# EAGLE design V2 (EAGLE 9.6.2)
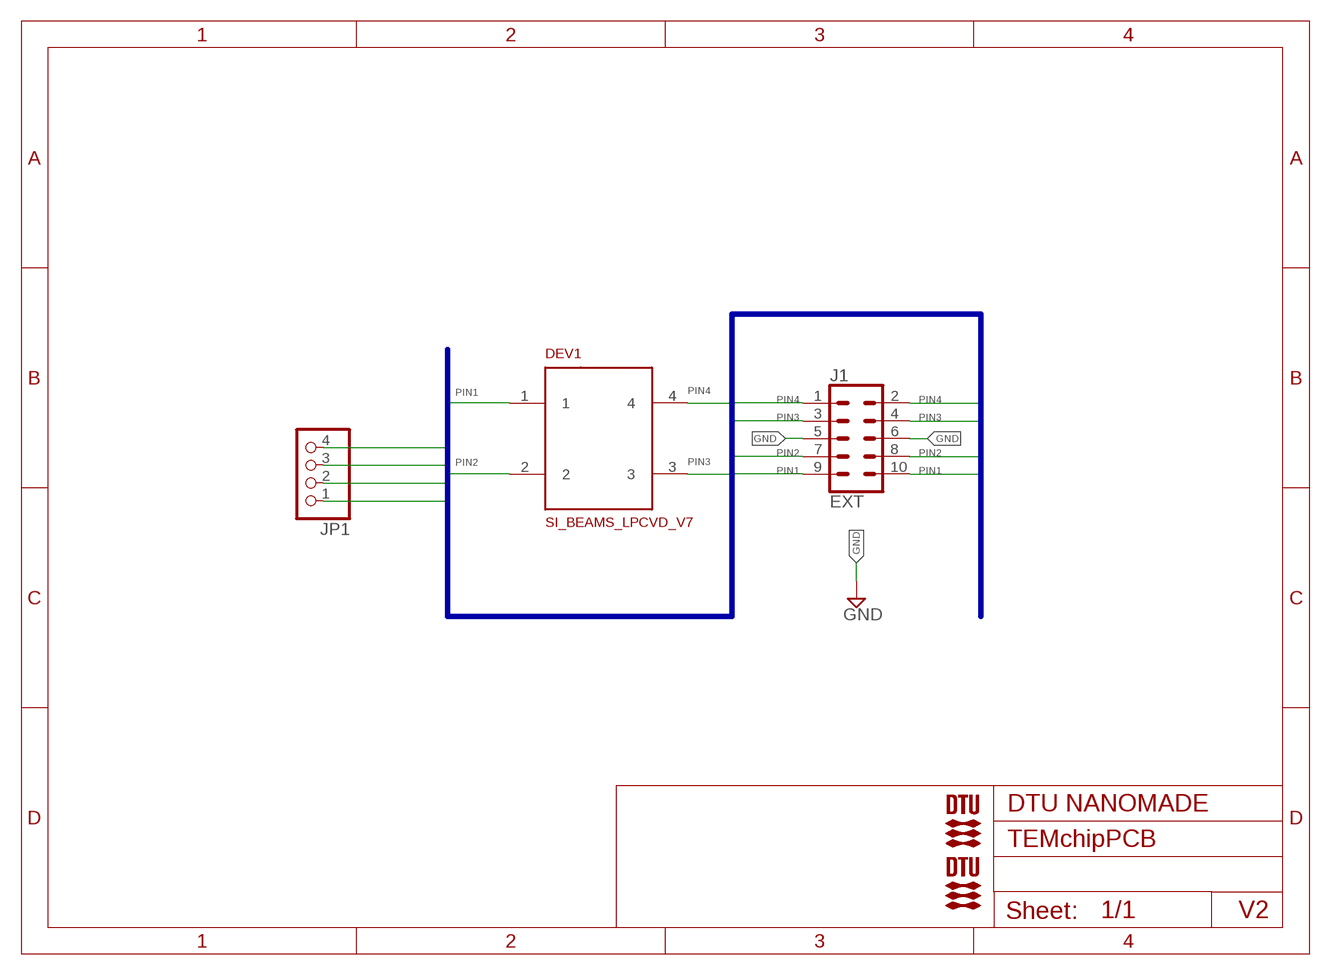
[diagram p0: schematic, sheet 1]

## Parts
DEV1  SI_BEAMS_LPCVD_V7  [SI_BEAMS_LPCVD_V7]
J1  EXT  CONN_05X2SHD  [2X5-SHROUDED]
JP1  PINHD-1X4  [1X04]
U$1  DTU_LOGO  [DTU]
U$2  DTU_LOGO  [DTU]

## Nets
GND: J1.5 J1.6
PIN1: DEV1.1 J1.9 J1.10 JP1.1
PIN2: DEV1.2 J1.7 J1.8 JP1.2
PIN3: DEV1.3 J1.3 J1.4 JP1.3
PIN4: DEV1.4 J1.1 J1.2 JP1.4

## Buses
MAIN:PIN1,PIN2,PIN3,PIN4

## Notes on the sheet
- DTU NANOMADE
- TEMchipPCB

## Library data of the parts
DEV1 = nanomade:SI_BEAMS_LPCVD_V7
J1 = SparkFun-Connectors:CONN_05X2: Multi connection point. Often used as Generic Header-pin footprint for 0.1 inch spaced/style header connections For AVR SPI programming port, see special device with nice symbol: "AVR_SPI_PROG_5x2.dev" You can populate with any combo of single row headers, but if you'd like an exact match, check these: 2x5 AVR ICSP Male Header <https://www.sparkfun.com/products/778> (PRT-00778) 2x5 Pin Shrouded Header <https://www.sparkfun.com/products/8506> (PRT-08506) On any of the 0.1 inch spaced packages, you can populate with these: Break Away Headers - Straight <https://www.sparkfun.com/products/116> (PRT-00116) Break Away Male Headers - Right Angle <https://www.sparkfun.com/products/553> (PRT-00553) Female Headers <https://www.sparkfun.com/products/115> (PRT-00115) Break Away Headers - Machine Pin <https://www.sparkfun.com/products/117> (PRT-00117) Break Away Female Headers - Swiss Machine Pin <https://www.sparkfun.com/products/743> (PRT-00743) Special note: the shrouded connector mates well with our 5x2 ribbon cables: 2x5 Pin IDC Ribbon Cable <https://www.sparkfun.com/products/8535> (PRT-08535); PROD_ID: CONN-08671; SF_ID: PRT-08506
JP1 = pinhead:PINHD-1X4: PIN HEADER
U$1 U$2 = iongate:DTU_LOGO: DTU Logo

## Board
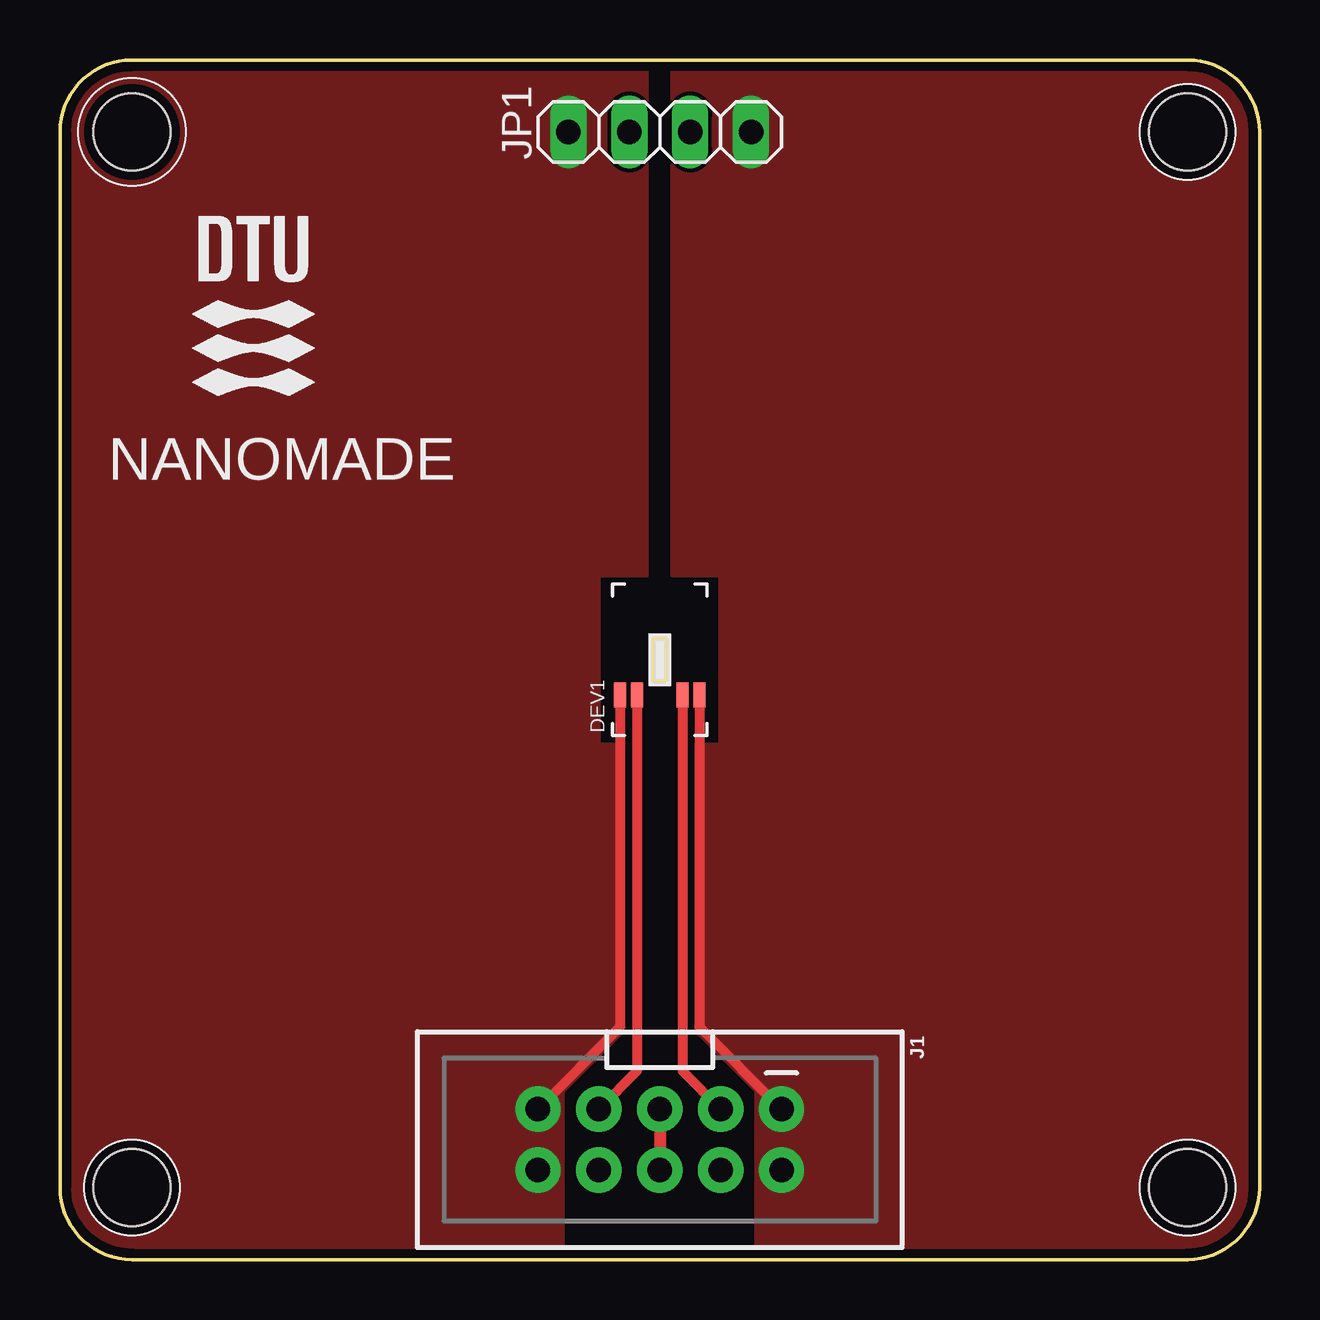
[diagram p1: board, top side]
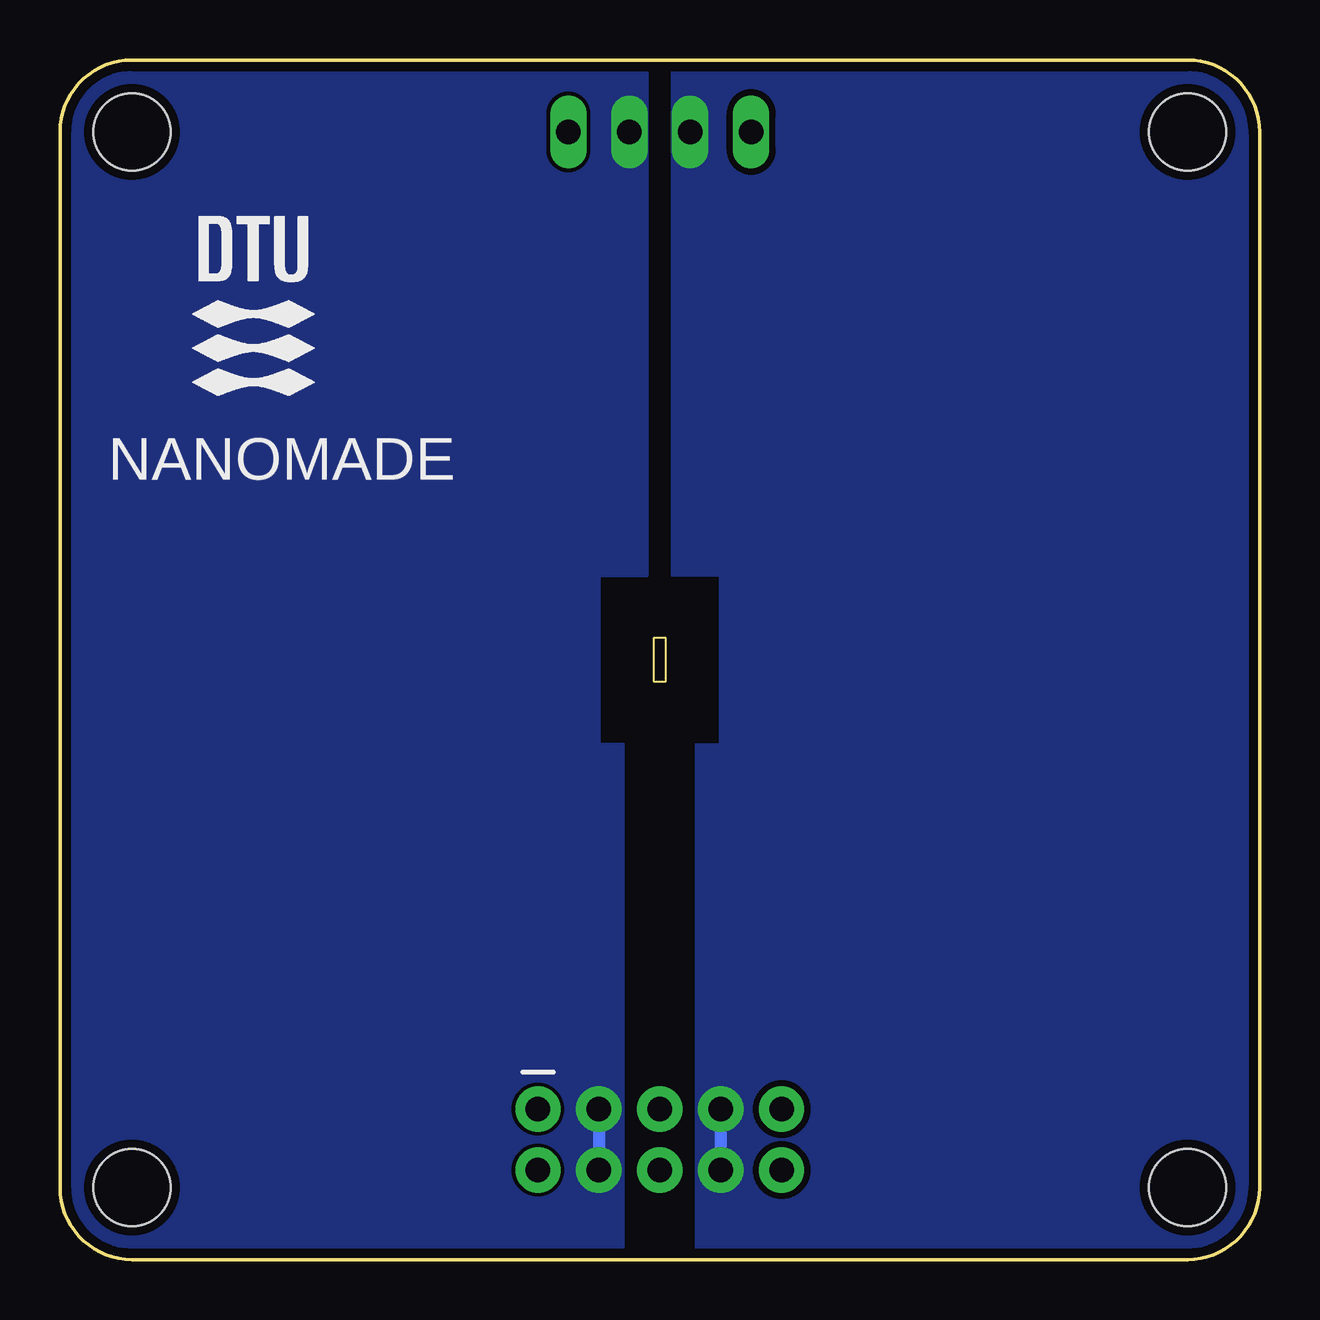
[diagram p2: board, bottom side, seen from below]

Size 50 x 50 mm. Coordinates in mm from the lower left corner, seen from the top.
Outline: 3,0 47,0 arc90 50,3 50,47 arc90 47,50 3,50 arc90 0,47 0,3 arc90 3,0
Outline: 24.74,25.9 25.26,25.9 25.26,24.1 24.74,24.1 24.74,25.9
Copper layers (1*16): Top 0.035mm / dielectric 1.5mm / Bottom 0.035mm
Design rules "default *": minimum track width 6mil, minimum drill 0.35mm, track to track 6mil, track to pad 6mil, pad to pad 6mil, via to via 6mil, smd to smd 6mil, copper to edge 15mil, drill to drill 6mil, minimum pad ring 10mil, minimum via ring 8mil, stop-mask expansion 4mil, vias tented up to drill 0mil, thermal gap 10mil
Holes 3.2 mm at 3,47 47,47 3,3 47,3

### Footprints (pad centres in the part's own frame; a part is rotated, then mirrored left to right if it is on the bottom)
SI_BEAMS_LPCVD_V7 = smd 0.5 x 1.05: 1 -1.65,-1.47; 2 -0.95,-1.47; 3 0.95,-1.47; 4 1.65,-1.47
2X5-SHROUDED = drill 1.016 pad 1.88: 1 -1.27,5.08; 2 1.27,5.08; 3 -1.27,2.54; 4 1.27,2.54; 5 -1.27,0; 6 1.27,0; 7 -1.27,-2.54; 8 1.27,-2.54; 9 -1.27,-5.08; 10 1.27,-5.08
1X04 = drill 1.016 long: 1 -3.81,0; 2 -1.27,0; 3 1.27,0; 4 3.81,0

### Placement (x,y rotation side)
DEV1  25,25 0 top
J1  25,5 270 top
JP1  25,47 0 top
U$1  5.5,36 0 top
U$2  44.5,36 0 bottom

### Tracks (layer width: path | path; a pad name or v marks a point on that pad's centre or on a via)
GND
  Top 0.5: J1.5 J1.6
PIN1
  Top 0.406: DEV1.1 23.35,9.7 J1.9
  pour Top (no thermals): 0,0 21,0 21,7 23.5,9.5 23.5,21.5 22.5,21.5 22.5,28.5 24.5,28.5 24.5,50 0,50
PIN2
  Top 0.406: DEV1.2 24.05,7.86 J1.7
  Bottom 0.5: J1.7 J1.8
  pour Bottom (isolate 0.254, no thermals): 0,0 23.5,0 23.5,21.5 22.5,21.5 22.5,28.5 24.5,28.5 24.5,50 0,50
PIN3
  Top 0.406: DEV1.3 25.95,7.86 J1.3
  Bottom 0.5: J1.3 J1.4
  pour Bottom (no thermals): 26.5,0 26.5,21.5 27.5,21.5 27.5,28.5 25.5,28.5 25.5,50 50,50 50,43 50,0
PIN4
  Top 0.406: DEV1.4 26.65,9.7 J1.1
  pour Top (no thermals): 50,0 29,0 29,7 26.5,9.5 26.5,21.5 27.5,21.5 27.5,28.5 25.5,28.5 25.5,50 50,50

### Text on the board
tNames: NANOMADE
bNames: NANOMADE